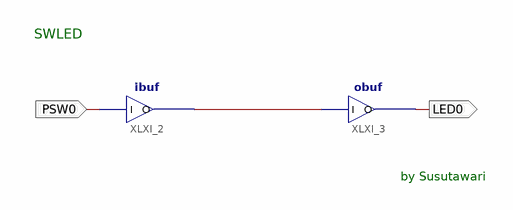
[diagram p0: schematic sheet 1]
// Xilinx ISE schematic SWLED.sch (spartan3a) as structural Verilog: 2 symbols, 2 ports
module SWLED (
  input  PSW0,
  output LED0
);

  wire XLXN_4;

  ibuf XLXI_2 (.I(PSW0), .O(XLXN_4));
  obuf XLXI_3 (.I(XLXN_4), .O(LED0));

  // Notes on the sheet:
  //   SWLED
  //   by Susutawari
endmodule
